# Altium project FX3U-14MR.PrjPcb (part 2 of 2)

## Sheet X07-X00.SchDoc
size A3; SheetNumber: 6; SheetTotal: 6
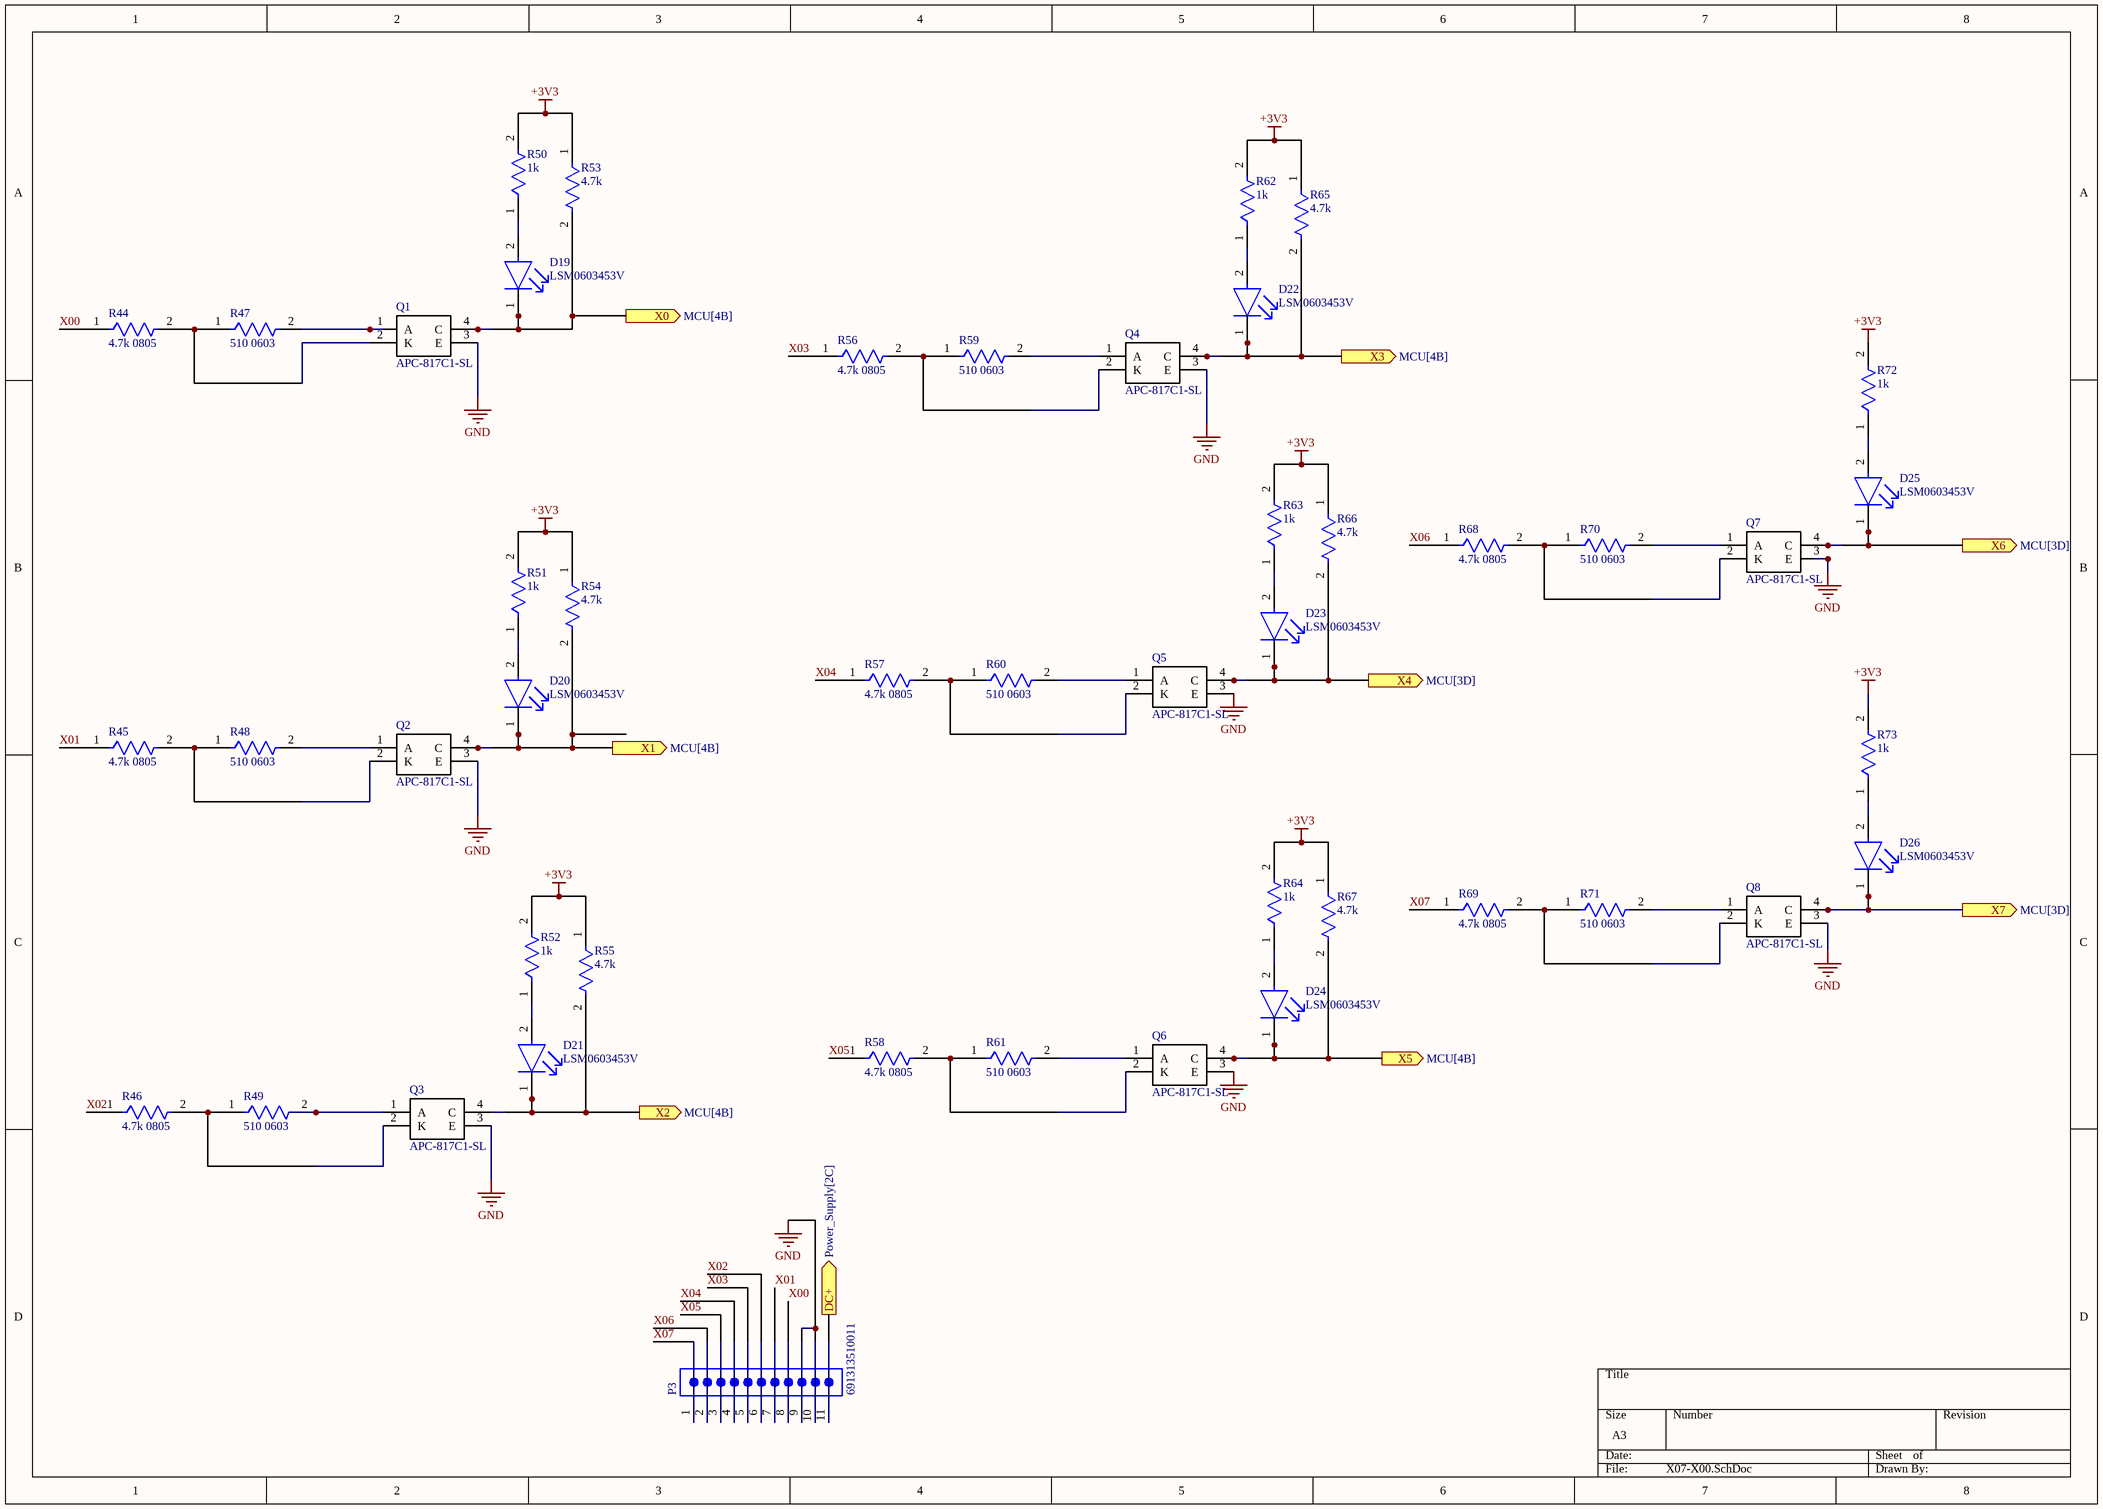
[diagram p5: X07-X00.SchDoc]

### Parts
D19  LSM0603453V  [FP-LSM0603453V-MFG]
D20  LSM0603453V  [FP-LSM0603453V-MFG]
D21  LSM0603453V  [FP-LSM0603453V-MFG]
D22  LSM0603453V  [FP-LSM0603453V-MFG]
D23  LSM0603453V  [FP-LSM0603453V-MFG]
D24  LSM0603453V  [FP-LSM0603453V-MFG]
D25  LSM0603453V  [FP-LSM0603453V-MFG]
D26  LSM0603453V  [FP-LSM0603453V-MFG]
P3  691313510011  [691313510011]
Q1  APC-817C1-SL  [APC817C1SL]
Q2  APC-817C1-SL  [APC817C1SL]
Q3  APC-817C1-SL  [APC817C1SL]
Q4  APC-817C1-SL  [APC817C1SL]
Q5  APC-817C1-SL  [APC817C1SL]
Q6  APC-817C1-SL  [APC817C1SL]
Q7  APC-817C1-SL  [APC817C1SL]
Q8  APC-817C1-SL  [APC817C1SL]
R44  4.7k 0805  [FP-MCU0805-MFG]
R45  4.7k 0805  [FP-MCU0805-MFG]
R46  4.7k 0805  [FP-MCU0805-MFG]
R47  510 0603  [FP-RMCF0603-IPC_C]
R48  510 0603  [FP-RMCF0603-IPC_C]
R49  510 0603  [FP-RMCF0603-IPC_C]
R50  1k  [FP-MCS0402-IPC_A]
R51  1k  [FP-MCS0402-IPC_A]
R52  1k  [FP-MCS0402-IPC_A]
R53  4.7k  [FP-TFCR0402-IPC_A]
R54  4.7k  [FP-TFCR0402-IPC_A]
R55  4.7k  [FP-TFCR0402-IPC_A]
R56  4.7k 0805  [FP-MCU0805-MFG]
R57  4.7k 0805  [FP-MCU0805-MFG]
R58  4.7k 0805  [FP-MCU0805-MFG]
R59  510 0603  [FP-RMCF0603-IPC_C]
R60  510 0603  [FP-RMCF0603-IPC_C]
R61  510 0603  [FP-RMCF0603-IPC_C]
R62  1k  [FP-MCS0402-IPC_A]
R63  1k  [FP-MCS0402-IPC_A]
R64  1k  [FP-MCS0402-IPC_A]
R65  4.7k  [FP-TFCR0402-IPC_A]
R66  4.7k  [FP-TFCR0402-IPC_A]
R67  4.7k  [FP-TFCR0402-IPC_A]
R68  4.7k 0805  [FP-MCU0805-MFG]
R69  4.7k 0805  [FP-MCU0805-MFG]
R70  510 0603  [FP-RMCF0603-IPC_C]
R71  510 0603  [FP-RMCF0603-IPC_C]
R72  1k  [FP-MCS0402-IPC_A]
R73  1k  [FP-MCS0402-IPC_A]

### Ports
DC+ (out, see Power_Supply[2C]), X0 (out, see MCU[4B]), X1 (out, see MCU[4B]), X2 (out, see MCU[4B]), X3 (out, see MCU[4B]), X4 (out, see MCU[3D]), X5 (out, see MCU[4B]), X6 (out, see MCU[3D]), X7 (out, see MCU[3D])

### Nets
+3V3: R50.2 R51.2 R52.2 R53.1 R54.1 R55.1 R62.2 R63.2 R64.2 R65.1 R66.1 R67.1 R72.2 R73.2
GND: P3.9 P3.10 Q1.3(E) Q2.3(E) Q3.3(E) Q4.3(E) Q5.3(E) Q6.3(E) Q7.3(E) Q8.3(E)
X00: P3.8 R44.1
X01: P3.7 R45.1
X02: P3.6 R46.1
X03: P3.5 R56.1
X04: P3.4 R57.1
X05: P3.3 R58.1
X06: P3.2 R68.1
X07: P3.1 R69.1
NetD19_1: D19.1(C) Q1.4(C) R53.2 ; port X0
NetD19_2: D19.2(A) R50.1
NetD20_1: D20.1(C) Q2.4(C) R54.2 ; port X1
NetD20_2: D20.2(A) R51.1
NetD21_1: D21.1(C) Q3.4(C) R55.2 ; port X2
NetD21_2: D21.2(A) R52.1
NetD22_1: D22.1(C) Q4.4(C) R65.2 ; port X3
NetD22_2: D22.2(A) R62.1
NetD23_1: D23.1(C) Q5.4(C) R66.2 ; port X4
NetD23_2: D23.2(A) R63.1
NetD24_1: D24.1(C) Q6.4(C) R67.2 ; port X5
NetD24_2: D24.2(A) R64.1
NetD25_1: D25.1(C) Q7.4(C) ; port X6
NetD25_2: D25.2(A) R72.1
NetD26_1: D26.1(C) Q8.4(C) ; port X7
NetD26_2: D26.2(A) R73.1
NetF1_1: P3.11 ; port DC+
NetQ1_1: Q1.1(A) R47.2
NetQ1_2: Q1.2(K) R44.2 R47.1
NetQ2_1: Q2.1(A) R48.2
NetQ2_2: Q2.2(K) R45.2 R48.1
NetQ3_1: Q3.1(A) R49.2
NetQ3_2: Q3.2(K) R46.2 R49.1
NetQ4_1: Q4.1(A) R59.2
NetQ4_2: Q4.2(K) R56.2 R59.1
NetQ5_1: Q5.1(A) R60.2
NetQ5_2: Q5.2(K) R57.2 R60.1
NetQ6_1: Q6.1(A) R61.2
NetQ6_2: Q6.2(K) R58.2 R61.1
NetQ7_1: Q7.1(A) R70.2
NetQ7_2: Q7.2(K) R68.2 R70.1
NetQ8_1: Q8.1(A) R71.2
NetQ8_2: Q8.2(K) R69.2 R71.1

### Library data of the parts
D19-D26 = CMP-00731-94024739-1: LSM0603453V LED SM 0603 3V -/1000/-mcd Green; Forward Current: 20mA; Forward Voltage: 2.3V; Viewing Angle: 120°; Reverse Voltage: 5V; Power Dissipation: 60mW; Wavelength: 576nm; Luminous Intensity: 120mcd; NexarPartId: 94024739; Height: 550µm; Max Operating Temperature: 85°C; Schedule B: 8541402000, 8541406050; Case/Package: 0603; Color: Green; Min Operating Temperature: -40°C
P3 = CMP-1502-02201-3: Terminal Block, 5.08MM Pitch, Close Horizontal Pcb Header, 300VAC, 11 Pins
Q1-Q8 = APC-817C1-SL: Phototransistor; Manufacturer_Name: American Bright Optoelectronics Corporation; Datasheet Link: https://www.americanbrightled.com/pdffiles/ir-uv/ir/APC-817.pdf; Height: 4.05mm; Manufacturer_Part_Number: APC-817C1-SL
R44-R46 R56-R58 R68 R69 = CMP-02407-001466-1: RES 1.05K OHM 0.5% 1/5W 0805; Max Power Dissipation: 125mW; Tolerance: 0.1%; Temperature Coefficient: 25ppm/°C; Resistance: 4.7kR; Composition: Thin Film; Case/Package: 0805; Lead Free: Lead Free; Min Operating Temperature: -55°C; Package Quantity: 5000; Packaging: Tape and Reel; Width: 0.049inch; Height: 0.022inch; Depth: 1.25mm; Number of Terminations: 2; Military Standard: Not; Max Operating Temperature: 125°C; Length: 0.079inch
R47-R49 R59-R61 R70 R71 = CMP-26527-002649-1: 510Ω ±5% 0.1W 0603 Thick Film Chip Resistor AEC-Q200 compliant; Resistance: 510R; Max Power Dissipation: 100mW; Temperature Coefficient: 200ppm/°C; Features: Automotive AEC-Q200; Mount: Surface Mount; Tolerance: 5%; Construction: Rectangular; Number of Terminations: 2; Case Code (Imperial): 0603; Lead Free: Lead Free; Military Standard: Not; Length: 0.061inch; Case/Package: 0603; Resistor Type: Thick Film; RoHS Compliant: Yes; Radiation Hardening: No; Case Code (Metric): 1608; Packaging: Tape and Reel; Width: 0.031inch; Power Rating: 100mW; Series: RMCF; Height: 0.022inch; Max Operating Temperature: 155°C; Depth: 0.8mm; Size Code: 0603; Contact Plating: Tin; Min Operating Temperature: -55°C
R50-R52 R62-R64 R72 R73 = CMP-02407-008912-1: RES SMD 1.2K OHM 1% 1/10W 0402
R53-R55 R65-R67 = CMP-250906-194630-1: RES Thin Film,  4.7kΩ, 0.5%, 0.063W, 25ppm/°C, 0402

## Nets that join several sheets
+3V3: Power_Supply (7 pins), MCU (25 pins), RS232 (C26.1 C30.2 U5.16), X07-X00 (14 pins)
+5V: Power_Supply (7 pins), DA0-1_AD0-AD5 (C32.1 R20.2 R75.2 U7.8)
+24V: Power_Supply (D1.2 D2.1 D3.1 D4.1), ULN2003 (14 pins), DA0-1_AD0-AD5 (U8.8 С1.2)
GND: Power_Supply (25 pins), MCU (37 pins), RS232 (C29.2 C30.1 J2.5 U5.15), ULN2003 (C31.2 U6.8), DA0-1_AD0-AD5 (26 pins), X07-X00 (10 pins)
NetC3_1: Power_Supply (C3.1 R1.1 R2.2), MCU (U3.64)
NetD6_1: Power_Supply (D6.1), MCU (U3.57)
NetD19_1: MCU (U3.52), X07-X00 (D19.1 Q1.4 R53.2)
NetD20_1: MCU (U3.53), X07-X00 (D20.1 Q2.4 R54.2)
NetD21_1: MCU (U3.48), X07-X00 (D21.1 Q3.4 R55.2)
NetD22_1: MCU (U3.51), X07-X00 (D22.1 Q4.4 R65.2)
NetD23_1: MCU (U3.46), X07-X00 (D23.1 Q5.4 R66.2)
NetD24_1: MCU (U3.47), X07-X00 (D24.1 Q6.4 R67.2)
NetD25_1: MCU (U3.44), X07-X00 (D25.1 Q7.4)
NetD26_1: MCU (U3.45), X07-X00 (D26.1 Q8.4)
NetF1_1: Power_Supply (F1.1), X07-X00 (P3.11)
NetR21_1: MCU (U3.16), DA0-1_AD0-AD5 (R21.1 R22.2)
NetR25_1: MCU (U3.15), DA0-1_AD0-AD5 (R25.1 R26.2)
NetR30_1: MCU (U3.34), DA0-1_AD0-AD5 (R30.1 R31.2)
NetR33_1: MCU (U3.29), DA0-1_AD0-AD5 (R33.1)
NetR34_2: MCU (U3.33), DA0-1_AD0-AD5 (R34.2 R35.2)
NetR39_1: MCU (U3.26), DA0-1_AD0-AD5 (R39.1 R40.2)
NetR41_2: MCU (U3.30), DA0-1_AD0-AD5 (R41.2)
NetR42_1: MCU (U3.24), DA0-1_AD0-AD5 (R42.1 R43.2)
NetU3_23: MCU (U3.23), ULN2003 (U6.3)
NetU3_59: MCU (U3.59), ULN2003 (U6.1)
NetU3_65: MCU (U3.65), ULN2003 (U6.5)
NetU3_66: MCU (U3.66), ULN2003 (U6.6)
NetU3_67: MCU (U3.67), ULN2003 (U6.4)
NetU3_68: MCU (U3.68), RS232 (U5.11)
NetU3_69: MCU (U3.69), RS232 (U5.12)
NetU3_78: MCU (U3.78), DA0-1_AD0-AD5 (U7.4)
NetU3_79: MCU (U3.79), DA0-1_AD0-AD5 (U7.1)
NetU3_89: MCU (U3.89), ULN2003 (U6.2)
SWCLK: MCU (J1.2 U3.76), DA0-1_AD0-AD5 (R75.1 U7.2 U7.3)